# EAGLE design cyberspace-1-clock-card (EAGLE 9.6.2)
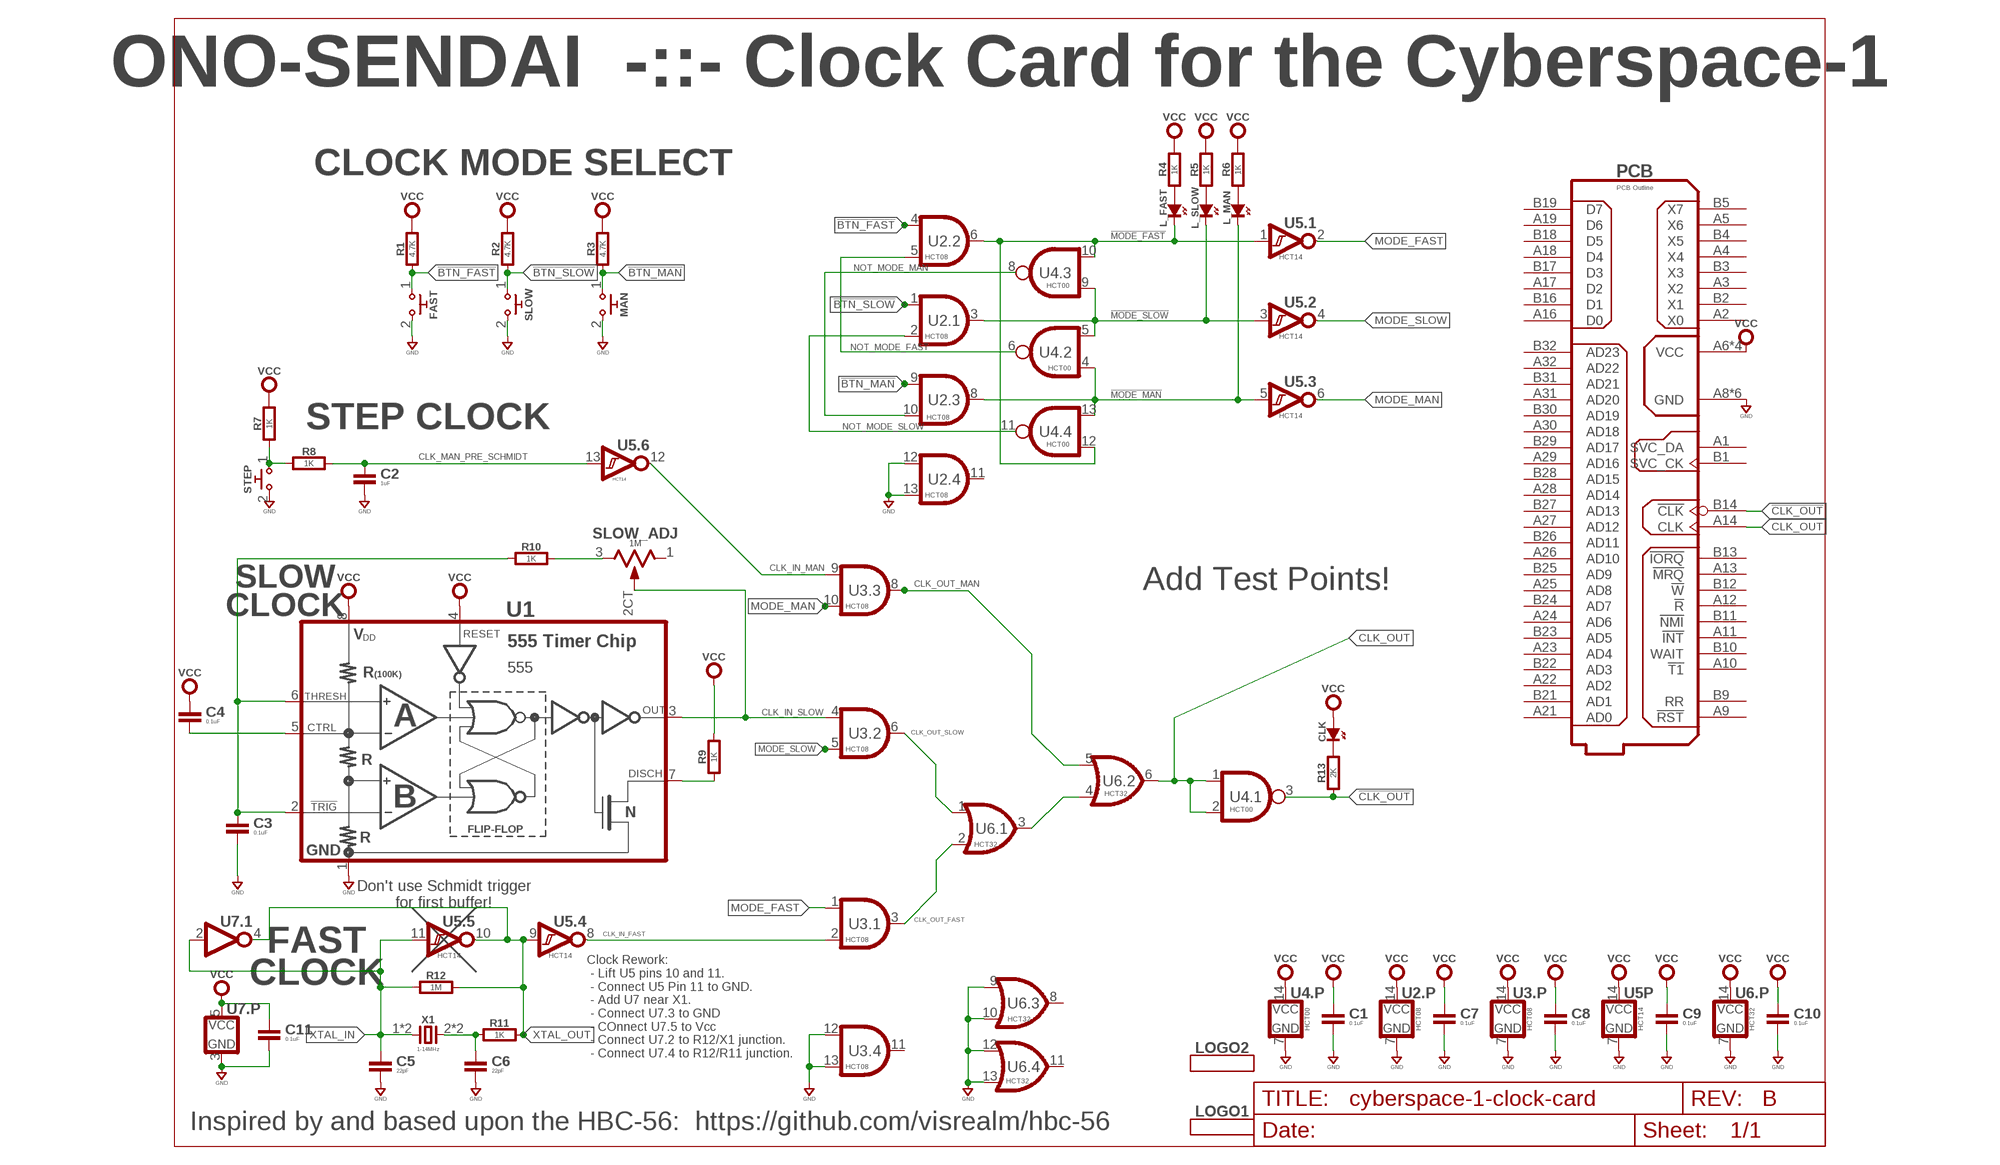
[diagram p0: schematic, sheet 1]
U$1 (DINA4_L-SMALLDOC): REV: B

## Parts
C1  0.1uF  CAPACITOR0603  [0603-CAP]
C2  1uF  CAPACITOR0603  [0603-CAP]
C3  0.1uF  CAPACITOR0603  [0603-CAP]
C4  0.1uF  CAPACITOR0603  [0603-CAP]
C5  22pF  CAPACITOR0603  [0603-CAP]
C6  22pF  CAPACITOR0603  [0603-CAP]
C7  0.1uF  CAPACITOR0603  [0603-CAP]
C8  0.1uF  CAPACITOR0603  [0603-CAP]
C9  0.1uF  CAPACITOR0603  [0603-CAP]
C10  0.1uF  CAPACITOR0603  [0603-CAP]
C11  0.1uF  CAPACITOR0603  [0603-CAP]
CLK  SMT0603  [SMD_0603]
FAST  TACTILESPST-RA-6X6  [TC-0202]
L_FAST  SMT0603  [SMD_0603]
L_MAN  SMT0603  [SMD_0603]
L_SLOW  SMT0603  [SMD_0603]
LOGO1  SOZU-BRAND-LOGO-20MM  [SOZU-20MM]
LOGO2  CHRONOS-LOGO-20MM  [CHRONOS2-20MM]
MAN  TACTILESPST-RA-6X6  [TC-0202]
PCB  PCB Outline  CYBERSPACE-1-CARD-1A  [CYBERSPACE-CARD-TYPE-1A]
R1  4.7K  RESISTOR0603  [0603-RES]
R2  4.7K  RESISTOR0603  [0603-RES]
R3  4.7K  RESISTOR0603  [0603-RES]
R4  1K  RESISTOR0603  [0603-RES]
R5  1K  RESISTOR0603  [0603-RES]
R6  1K  RESISTOR0603  [0603-RES]
R7  1K  RESISTOR0603  [0603-RES]
R8  1K  RESISTOR0603  [0603-RES]
R9  1K  RESISTOR0603  [0603-RES]
R10  1K  RESISTOR0603  [0603-RES]
R11  1K  RESISTOR0603  [0603-RES]
R12  1M  RESISTOR0603  [0603-RES]
R13  2K  RESISTOR0603  [0603-RES]
SLOW  TACTILESPST-RA-6X6  [TC-0202]
SLOW_ADJ  1M  CERMET_MULTI_TURN-3006P  [CERMET_MULTI_3006P_THD]
STEP  TACTILESPST-RA-6X6  [TC-0202]
U1  555  555SOIC  [SOP08]
U2  HCT08  74HCT08D  [SOP14]
U3  HCT08  74HCT08D  [SOP14]
U4  HCT00  74AHCT00D  [SOP14]
U5  HCT14  74HCT14D  [SOP14]
U6  HCT32  74HCT32D  [SOP14]
U7  74HCT1G-TSOP504  [TSOP-5]
X1  1-14MHz  2PATS_DUAL_SMD_THD  [ATSXXXX]

## Nets
!BTN_FAST: FAST.1 R1.1 U2.4(.2:A)
!BTN_MAN: MAN.1 R3.1 U2.9(.3:A)
!BTN_SLOW: R2.1 SLOW.1 U2.1(.1:A)
!CLK_OUT: PCB.B14(!CLK) R13.1 U4.3(.1:Y)
!MODE_FAST: L_FAST.K(C) U2.6(.2:Y) U4.10(.3:A) U4.12(.4:B) U5.1(.1:A)
!MODE_MAN: L_MAN.K(C) U2.8(.3:Y) U4.4(.2:A) U4.13(.4:A) U5.5(.3:A)
!MODE_SLOW: L_SLOW.K(C) U2.3(.1:Y) U4.5(.2:B) U4.9(.3:B) U5.3(.2:A)
CLK_IN_FAST: U3.2(.1:B) U5.8(.4:Y)
CLK_IN_MAN: U3.9(.3:A) U5.12(.6:Y)
CLK_IN_SLOW: SLOW_ADJ.2CT U1.3(OUTPUT) U3.4(.2:A)
CLK_MAN_PRE_SCHMIDT: C2.1 R8.2 U5.13(.6:A)
CLK_OUT: PCB.A14(CLK) U4.1(.1:A) U4.2(.1:B) U6.6(.2:Y)
CLK_OUT_FAST: U3.3(.1:Y) U6.2(.1:B)
CLK_OUT_MAN: U3.8(.3:Y) U6.5(.2:B)
CLK_OUT_SLOW: U3.6(.2:Y) U6.1(.1:A)
GND: C1.2 C2.2 C3.2 C5.2 C6.2 C7.2 C8.2 C9.2 C10.2 C11.2 FAST.2 MAN.2 PCB.A8(GND) PCB.A15(GND) PCB.A20(GND) PCB.B8(GND) PCB.B15(GND) PCB.B20(GND) SLOW.2 STEP.2 U1.1(GND) U2.7(.P:GND) U2.12(.4:A) U2.13(.4:B) U3.7(.P:GND) U3.12(.4:A) U3.13(.4:B) U4.7(.P:GND) U5.7(P:GND) U6.7(.P:GND) U6.9(.3:A) U6.10(.3:B) U6.12(.4:A) U6.13(.4:B) U7.3(.P:GND)
MODE_FAST: U3.1(.1:A) U5.2(.1:Y)
MODE_MAN: U3.10(.3:B) U5.6(.3:Y)
MODE_SLOW: U3.5(.2:B) U5.4(.2:Y)
N$1: C3.1 R10.1 U1.2(TRIGGER#) U1.6(THRESHOLD)
N$2: R9.1 U1.7(DISCHARGE)
N$3: C4.2 U1.5(CONTROL)
N$4: C6.1 R11.1 X1.2 X1.2SMD
N$5: R10.2 SLOW_ADJ.3
N$6: U6.3(.1:Y) U6.4(.2:A)
N$7: L_FAST.A R4.1
N$8: R7.1 R8.1 STEP.1
N$9: L_SLOW.A R5.1
N$10: L_MAN.A R6.1
N$11: CLK.K(C) R13.2
NOT_MODE_FAST: U2.5(.2:B) U4.6(.2:Y)
NOT_MODE_MAN: U2.10(.3:B) U4.8(.3:Y)
NOT_MODE_SLOW: U2.2(.1:B) U4.11(.4:Y)
VCC: C1.1 C4.1 C7.1 C8.1 C9.1 C10.1 C11.1 CLK.A PCB.A6(VCC) PCB.A7(VCC) PCB.B6(VCC) PCB.B7(VCC) R1.2 R2.2 R3.2 R4.2 R5.2 R6.2 R7.2 R9.2 U1.4(RESET#) U1.8(VDD) U2.14(.P:VCC) U3.14(.P:VCC) U4.14(.P:VCC) U5.14(P:VCC) U6.14(.P:VCC) U7.5(.P:VCC)
XTAL_IN: C5.1 R12.1 U5.11(.5:A) U7.2(.1:A) X1.1 X1.1SMD
XTAL_OUT: R11.2 R12.2 U5.9(.4:A) U5.10(.5:Y) U7.4(.1:Y)
Unconnected: PCB.A1(SVC_DA) PCB.A2(X0) PCB.A3(X2) PCB.A4(X4) PCB.A5(X6) PCB.A9(!RST) PCB.A10(!T1) PCB.A11(!INT) PCB.A12(!R) PCB.A13(!MRQ) PCB.A16(D0) PCB.A17(D2) PCB.A18(D4) PCB.A19(D6) PCB.A21(AD0) PCB.A22(AD2) PCB.A23(AD4) PCB.A24(AD6) PCB.A25(AD8) PCB.A26(AD10) PCB.A27(AD12) PCB.A28(AD14) PCB.A29(AD16) PCB.A30(AD18) PCB.A31(AD20) PCB.A32(AD22) PCB.B1(SVC_CK) PCB.B2(X1) PCB.B3(X3) PCB.B4(X5) PCB.B5(X7) PCB.B9(RR) PCB.B10(WAIT) PCB.B11(!NMI) PCB.B12(!W) PCB.B13(!IORQ) PCB.B16(D1) PCB.B17(D3) PCB.B18(D5) PCB.B19(D7) PCB.B21(AD1) PCB.B22(AD3) PCB.B23(AD5) PCB.B24(AD7) PCB.B25(AD9) PCB.B26(AD11) PCB.B27(AD13) PCB.B28(AD15) PCB.B29(AD17) PCB.B30(AD19) PCB.B31(AD21) PCB.B32(AD23) SLOW_ADJ.1 U2.11(.4:Y) U3.11(.4:Y) U6.8(.3:Y) U6.11(.4:Y)

## Notes on the sheet
- ONO-SENDAI  -::- Clock Card for the Cyberspace-1
- CLOCK MODE SELECT
- STEP CLOCK
- SLOW
  CLOCK
- Add Test Points!
- Don't use Schmidt trigger
  for first buffer!
- FAST
  CLOCK
- Clock Rework:
   - Lift U5 pins 10 and 11.
   - Connect U5 Pin 11 to GND.
   - Add U7 near X1.
   - Connect U7.3 to GND
   - COnnect U7.5 to Vcc
   - Connect U7.2 to R12/X1 junction.
   - Connect U7.4 to R12/R11 junction.
- Inspired by and based upon the HBC-56:  https://github.com/visrealm/hbc-56

## Library data of the parts
C1-C11 = rlc:CAPACITOR: Capacitor; COST01: 0.12; COST10: 0.09; COST100: 0.05
CLK L_FAST L_MAN L_SLOW = led:SMT: LED SMT; COST01: 0.20; COST10: 0.17; COST100: 0.14
FAST MAN SLOW STEP = switch-thd:TACTILE: Push Sw.
LOGO1 = gfx-glyphs:SOZU-BRAND-LOGO: Logo for the Sozu ficticious brand
LOGO2 = gfx-glyphs:CHRONOS-LOGO: Chronos 2 - Logo
PCB = con-edge:CYBERSPACE-1-CARD: Card for the CyberSpace 1 System
R1-R13 = rlc:RESISTOR: Resistor; COST01: 0.10; COST10: 0.05; COST100: 0.02
SLOW_ADJ = rlc:CERMET_MULTI_TURN: Cermet Style, Multiturn Potentiometer; COST01: 2.00; COST10: 1.70; COST100: 1.40; MFR: BOURNES; MPN: 3006P; TAYDA: https://www.taydaelectronics.com/potentiometer-variable-resistors/cermet-potentiometers.html
U1 = logic:555: Timer Chip; MFR: TI; MPN: NE555PSR
U2 U3 = logic:74*08?: Quad AND Gate; COST01: 0.50; COST10: 0.35; COST100: 0.20; MPN: 74HCT08D
U4 = logic:74*00?: Quad Nand Gate; MPN: 74HCT00D
U5 = logic:74*14?: Hex Schmidt Inverter; COST01: 0.45; COST10: 0.35; COST100: 0.20; MPN: 74HCT14D
U6 = logic:74*32?: Quad OR; COST01: 0.45; COST10: 0.35; COST100: 0.20; MPN: 74HCT32D
U7 = logic:74*1G?04: Single Gate Inverter; COST01: 0.35; COST10: 0.24; COST100: 0.12; MFR: Nexperia; MPN: 74HCT1G04GV
X1 = xtal:2P: Crystal

## Board
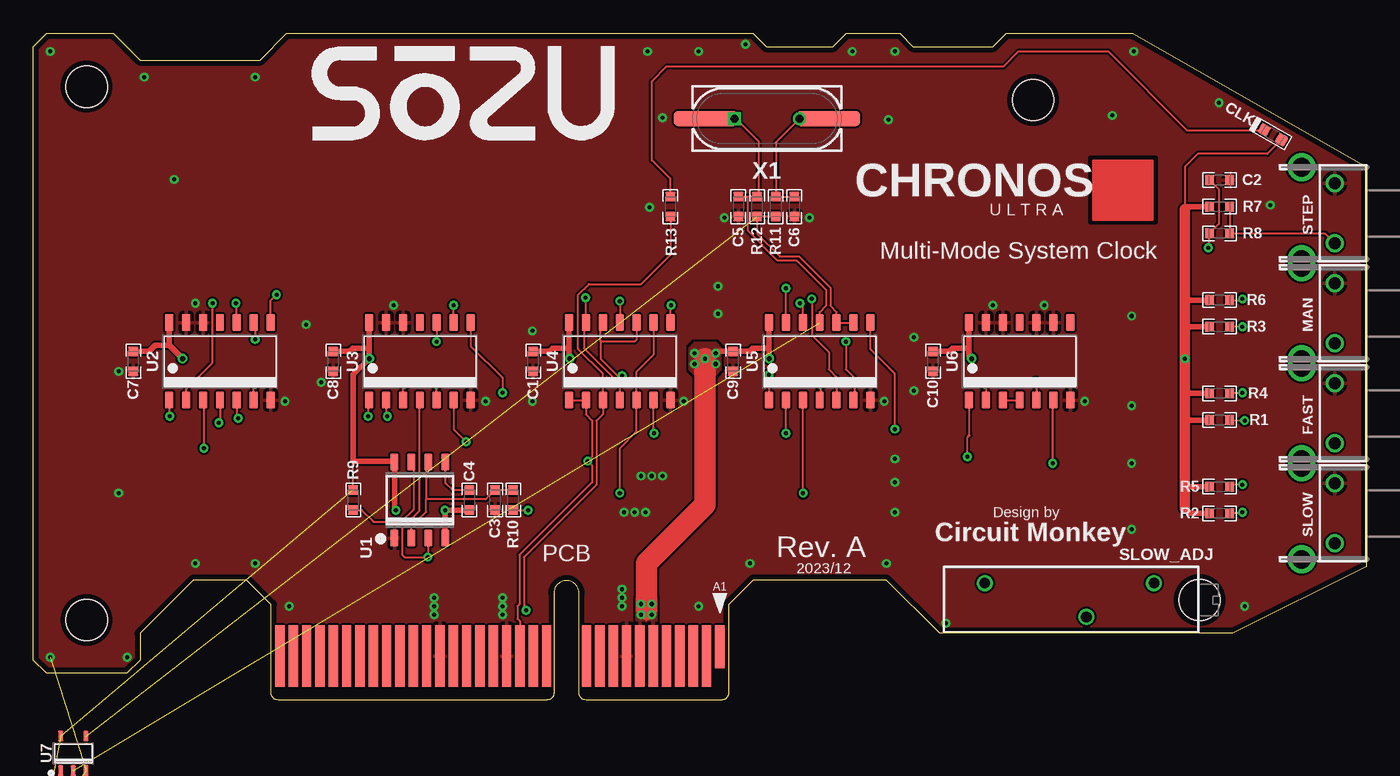
[diagram p1: board, top side]
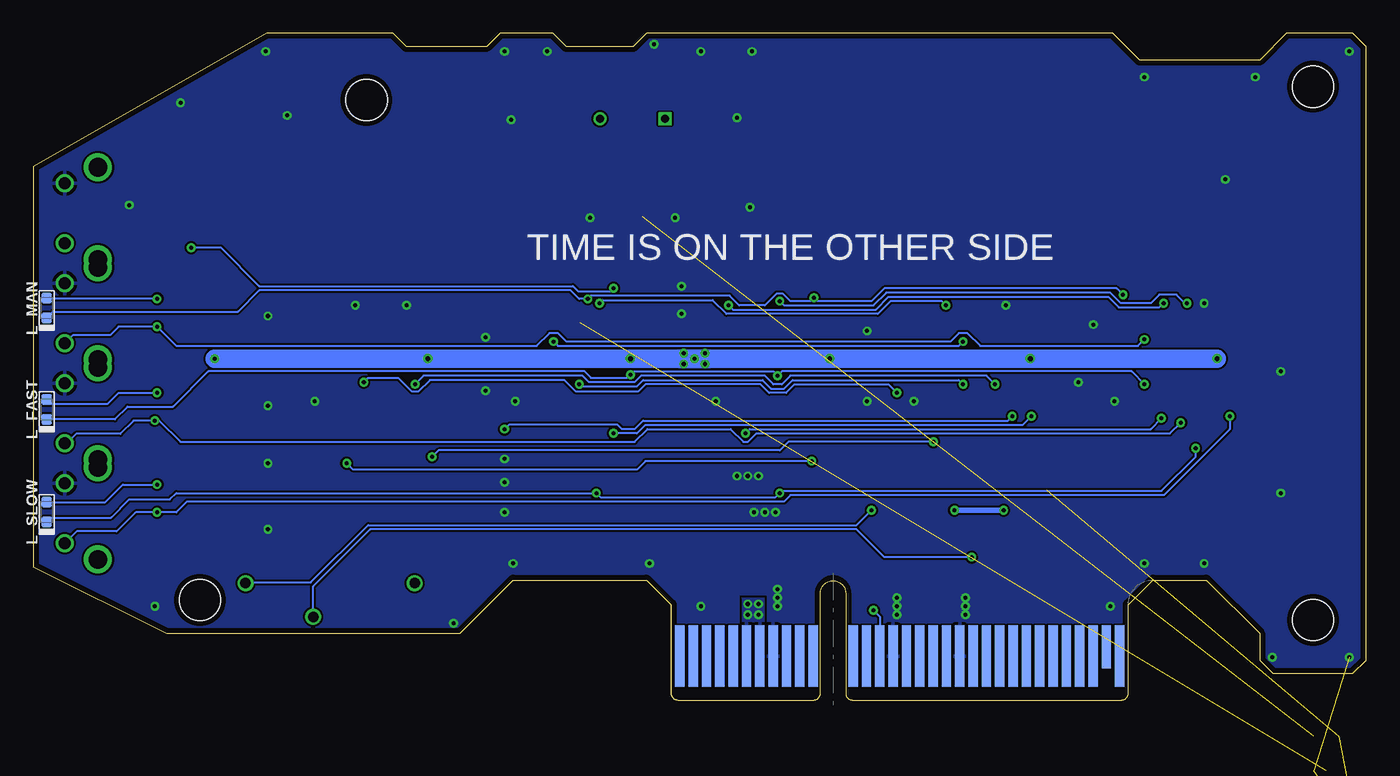
[diagram p2: board, bottom side, seen from below]

Size 100 x 50 mm. Coordinates in mm from the lower left corner, seen from the top.
Copper layers (1*16): Top 0.0356mm / dielectric 1.5011mm / Bottom 0.0356mm
Design rules "OSH-CircuitMonkey *": minimum track width 6mil, minimum drill 12mil, track to track 6mil, track to pad 6mil, pad to pad 6mil, via to via 6mil, smd to smd 6mil, copper to edge 15mil, drill to drill 6mil, minimum pad ring 7mil, minimum via ring 7mil, stop-mask expansion 3mil, vias tented up to drill 15mil, thermal gap 10mil

### Footprints (pad centres in the part's own frame; a part is rotated, then mirrored left to right if it is on the bottom)
0603-CAP = smd 0.711 x 0.762: 1 -0.752,0; 2 0.752,0
SMD_0603 = smd 0.8 x 0.8: A 0.75,0; K -0.75,0
TC-0202 = drill 0.9: 1 -2.25,2.35; 2 2.25,2.35 | drill 1.4: MT1 -3.45,4.85; MT2 3.45,4.85
CYBERSPACE-CARD-TYPE-1A = smd 0.7 x 3.2: A1 11.5,4 | smd 0.7 x 4.6: A2 10.5,3.3; A3 9.5,3.3; A4 8.5,3.3; A5 7.5,3.3; A6 6.5,3.3; A7 5.5,3.3; A8 4.5,3.3; A9 3.5,3.3; A10 2.5,3.3; A11 1.5,3.3; A12 -1.5,3.3; A13 -2.5,3.3; A14 -3.5,3.3; A15 -4.5,3.3; A16 -5.5,3.3; A17 -6.5,3.3; A18 -7.5,3.3; A19 -8.5,3.3; A20 -9.5,3.3; A21 -10.5,3.3; A22 -11.5,3.3; A23 -12.5,3.3; A24 -13.5,3.3; A25 -14.5,3.3; A26 -15.5,3.3; A27 -16.5,3.3; A28 -17.5,3.3; A29 -18.5,3.3; A30 -19.5,3.3; A31 -20.5,3.3; A32 -21.5,3.3 | smd 0.7 x 4.6 bottom: B1 11.5,3.3; B2 10.5,3.3; B3 9.5,3.3; B4 8.5,3.3; B5 7.5,3.3; B6 6.5,3.3; B7 5.5,3.3; B8 4.5,3.3; B9 3.5,3.3; B10 2.5,3.3; B11 1.5,3.3; B12 -1.5,3.3; B13 -2.5,3.3; B14 -3.5,3.3; B15 -4.5,3.3; B16 -5.5,3.3; B17 -6.5,3.3; B18 -7.5,3.3; B19 -8.5,3.3; B20 -9.5,3.3; B21 -10.5,3.3; B22 -11.5,3.3; B23 -12.5,3.3; B24 -13.5,3.3; B25 -14.5,3.3; B26 -15.5,3.3; B27 -16.5,3.3; B28 -17.5,3.3; B29 -18.5,3.3; B30 -19.5,3.3; B32 -21.5,3.3 | smd 0.7 x 3.2 bottom: B31 -20.5,4 | hole 3.1: -36,46; -36,6; 47.5,7.5; 35,45
0603-RES = smd 0.711 x 0.762: 1 -0.752,0; 2 0.752,0
CERMET_MULTI_3006P_THD = drill 0.8: 1 -7.62,1.27; 2CT 0,-1.27; 3 5.08,1.27
SOP08 = smd 0.6 x 1.3: 1 -1.905,-2.85; 2 -0.635,-2.85; 3 0.635,-2.85; 4 1.905,-2.85; 5 1.905,2.85; 6 0.635,2.85; 7 -0.635,2.85; 8 -1.905,2.85
SOP14 = smd 1.27 x 0.635: 1 -2.9,3.81; 2 -2.9,2.54; 3 -2.9,1.27; 4 -2.9,0; 5 -2.9,-1.27; 6 -2.9,-2.54; 7 -2.9,-3.81; 8 2.9,-3.81; 9 2.9,-2.54; 10 2.9,-1.27; 11 2.9,0; 12 2.9,1.27; 13 2.9,2.54; 14 2.9,3.81
TSOP-5 = smd 0.4 x 0.8: 1 -0.95,-1.3; 2 0,-1.3; 3 0.95,-1.3; 4 0.95,1.3; 5 -0.95,1.3
ATSXXXX = drill 0.6 square: 1 -2.44,0 | smd 4.8 x 1.1: 1SMD -4.6,0; 2SMD 4.6,0 | drill 0.6: 2 2.44,0

### Placement (x,y rotation side)
C1  37.5,25.4 270 top
C2  89,39 0 top
C3  34.64,15 270 top
C4  32.72,15 90 top
C5  52.9,37 270 top
C6  57.1,37 270 top
C7  7.5,25.4 270 top
C8  22.5,25.4 270 top
C9  52.5,25.4 270 top
C10  67.5,25.4 270 top
C11  2,-7 0 top  (outside the outline)
CLK  93,42.4 330 top
FAST  100,21.5 90 top
L_FAST  99,21.8 90 bottom
L_MAN  99,29.4 90 bottom
L_SLOW  99,14.1 90 bottom
LOGO1  32.6,40 0 top
LOGO2  73.1,38.4 0 top
MAN  100,29 90 top
PCB  40,0 0 top
R1  89,21 180 top
R2  89,14 180 top
R3  89,28 180 top
R4  89,23 180 top
R5  89,16 180 top
R6  89,30 180 top
R7  89,37 180 top
R8  89,35 180 top
R9  24,15 90 top
R10  36,15 270 top
R11  55.7,37 270 top
R12  54.3,37 270 top
R13  47.8,37 90 top
SLOW  100,14 90 top
SLOW_ADJ  79,7.5 0 top
STEP  100,36.5 90 top
U1  29,15 0 top
U2  14,25.4 90 top
U3  29,25.4 90 top
U4  44,25.4 90 top
U5  59,25.4 90 top
U6  74,25.4 90 top
U7  3,-4 0 top
X1  55.04,43.6 0 top

### Tracks (layer width: path | path; a pad name or v marks a point on that pad's centre or on a via)
!BTN_FAST  (via drill 0.3)
  Top 0.152: U2.4 14,20.88 v13.92,20.8 | v90.88,20.96 89.79,20.96 R1.1
  Bottom 0.152: v13.92,20.8 14.72,20 45.76,20 46.4,19.36 46.72,19.36 47.68,20.32 53.92,20.32 54.88,19.36 88.96,19.36 90.56,20.96 v90.88,20.96 92.48,20.96 93.47,19.97 96.8,19.97 97.52,19.25 FAST.1
!BTN_MAN  (via drill 0.3)
  Top 0.152: U2.9 16.64,28.2 v16.64,27.04 | v90.72,28 R3.1
  Bottom 0.152: v16.64,27.04 17.12,26.56 28.96,26.56 29.92,27.52 30.56,27.52 31.2,26.88 60,26.88 60.64,27.52 61.28,27.52 62.24,26.56 89.28,26.56 v90.72,28 93.6,28 94.24,27.36 97.04,27.36 MAN.1
!BTN_SLOW  (via drill 0.3)
  Top 0.152: U2.1 10.19,21.33 v10.24,21.28 | v90.72,14.08 90.64,14 R2.1
  Bottom 0.152: v10.24,21.28 10.24,20.32 15.2,15.36 43.2,15.36 43.68,14.88 88.48,14.88 89.28,14.08 v90.72,14.08 92.32,14.08 93.76,12.64 96.76,12.64 SLOW.1
!CLK_OUT  (via drill 0.3)
  Top 0.152: v36.96,6.72 36.8,6.88 36.8,10.72 42.24,16.16 42.24,20.96 42.73,21.45 U4.3 42.73,24.47 40.88,26.32 40.88,30.4 41.68,31.2 45.6,31.2 47.8,33.4 R13.1
  Bottom 0.152: v36.96,6.72 36.48,6.24 36.48,3.32 PCB.B14
!MODE_FAST  (via drill 0.3)
  Top 0.152: U2.6 16.54,23.58 v16.64,23.68 | v44.16,24.32 43.84,24.32 42.56,25.6 42.56,26.88 | 42.56,26.88 42.56,28.13 U4.12 | U4.10 45.27,27.03 45.12,26.88 42.56,26.88 | v55.2,24.4 U5.1
  Bottom 0.152: v16.64,23.68 17.6,24.64 43.84,24.64 v44.16,24.32 44.48,24.64 54.96,24.64 v55.2,24.4 55.44,24.16 58.16,24.16 58.64,24.64 86.88,24.64 89.51,22.01 92.92,22.01 93.88,21.05 L_FAST.K
!MODE_MAN  (via drill 0.3)
  Top 0.152: U2.8 17.81,29.97 v18.24,30.4 | v41.44,30.16 41.44,28.32 U4.13 41.3,28.14 41.3,26.38 44,23.68 U4.4 | v58.4,30.08 58.4,27.36 59.68,26.08 59.68,24.8 60.27,24.21 U5.5
  Bottom 0.152: v18.24,30.4 18.72,30.88 36.16,30.88 37.12,29.92 41.2,29.92 v41.44,30.16 41.68,29.92 43.2,29.92 43.76,30.48 44.24,30.48 45.12,29.6 47.04,29.6 47.76,30.32 58.16,30.32 v58.4,30.08 59.04,30.08 59.68,30.72 83.04,30.72 84.64,29.12 98.53,29.12 L_MAN.K
!MODE_SLOW  (via drill 0.3)
  Top 0.152: v57.76,15.52 57.76,22.47 U5.3 | v44,15.52 44,18.88 45.27,20.15 U4.5 45.27,24.63 46.56,25.92 46.56,28.28 U4.9 | v12.8,18.88 12.8,22.43 U2.3
  Bottom 0.152: L_SLOW.K 98.68,13.67 94.17,13.67 92.8,15.04 89.76,15.04 89.28,15.52 v57.76,15.52 57.44,15.2 44.32,15.2 v44,15.52 43.84,15.68 15.36,15.68 12.8,18.24 v12.8,18.88
CLK_IN_FAST  (via drill 0.3)
  Top 0.152: v64.64,20.32 64.64,24.48 62.81,26.31 U5.8 | U3.2 26.46,21.38 v26.56,21.28
  Bottom 0.152: v64.64,20.32 64.32,20.64 56.16,20.64 55.84,20.32 54.88,20.32 54.24,20.96 26.88,20.96 v26.56,21.28
CLK_IN_MAN  (via drill 0.3)
  Top 0.152: U3.9 31.54,29.58 v31.52,29.6 | U5.12 57.73,29.5 57.52,29.71 v57.52,29.76
  Bottom 0.152: v31.52,29.6 31.84,29.92 35.68,29.92 36.64,28.96 48,28.96 49.04,30 57.28,30 v57.52,29.76
CLK_IN_SLOW  (via drill 0.3)
  Top 0.152: U3.4 28.96,22.46 28.96,14.16 27.68,12.88 27.68,10.88 27.84,10.72 v29.6,10.72 29.64,10.76 U1.3
  Bottom 0.152: v29.6,10.72 36.16,10.72 38.24,12.8 74.72,12.8 79,8.52 SLOW_ADJ.2CT
CLK_MAN_PRE_SCHMIDT  (via drill 0.3)
  Top 0.152: U5.13 56.46,30.86 v56.48,30.88 | v88.16,33.92 88.25,34.01 R8.2 88.96,35.71 88.96,38.29 C2.1
  Bottom 0.152: v56.48,30.88 56.72,30.64 59.12,30.64 59.52,31.04 83.04,31.04 85.92,33.92 v88.16,33.92
CLK_OUT  (via drill 0.3)
  Top 0.152: PCB.A14 36.5,5.9 36.32,6.08 36.32,7.04 36.48,7.2 36.48,10.88 41.92,16.32 41.92,17.6 v41.6,17.92 41.92,18.24 41.92,20.96 41.46,21.42 U4.2 U4.1 | v76.48,17.76 76.48,22.44 U6.6
  Bottom 0.152: v41.6,17.92 54.08,17.92 54.72,17.28 76,17.28 v76.48,17.76
CLK_OUT_FAST  (via drill 0.3)
  Top 0.152: U3.3 27.73,23.57 v27.84,23.68 | v71.36,23.68 71.46,23.58 U6.2
  Bottom 0.152: v27.84,23.68 28.48,24.32 43.2,24.32 43.84,23.68 44.48,23.68 45.12,24.32 54.4,24.32 54.88,23.84 58.32,23.84 58.8,24.32 70.72,24.32 v71.36,23.68
CLK_OUT_MAN  (via drill 0.3)
  Top 0.152: U3.8 32.81,26.55 35.2,24.16 v35.2,23.04 | v75.2,23.84 75.27,23.77 U6.5
  Bottom 0.152: v35.2,23.04 35.84,23.68 42.88,23.68 43.52,23.04 44.8,23.04 45.44,23.68 54.08,23.68 54.64,23.12 59.28,23.12 60.16,24 70.24,24 71.12,23.12 71.6,23.12 72.64,24.16 74.88,24.16 v75.2,23.84
CLK_OUT_SLOW  (via drill 0.3)
  Top 0.152: U3.6 31.54,20.3 v32.48,19.36 | v70.08,18.24 70.08,19.68 70.24,19.84 70.24,22.45 U6.1
  Bottom 0.152: v32.48,19.36 43.36,19.36 44,18.72 69.6,18.72 v70.08,18.24
GND  (via drill 0.3)  (2 unrouted)
  other vias: 1.28,3.2 7.04,3.2 1.28,48.64 8.32,46.72 16.64,46.72 53.42,49.18 46.08,48.64 49.92,48.64 61.44,48.64 64.64,48.64 82.56,48.64 88.96,44.8 92.8,37.12 90.88,7.04 68.48,5.76 64,10.24 53.76,10.24 49.92,7.04 44.16,7.04 44.16,7.68 44.16,8.32 35.2,6.4 35.2,7.04 35.2,7.68 30.08,6.4 30.08,7.04 30.08,7.68 19.2,7.04 16.64,10.24 12.16,10.24 18.88,22.4 33.92,22.4 27.04,29.6 12.16,29.76 6.4,24.64 21.6,23.84 37.44,22.4 37.44,27.68 48.8,22.4 63.84,22.4 72,29.6 75.84,29.6 78.88,22.4 66.08,23.2 66.08,27.2 44.32,14.08 45.12,14.08 45.92,14.08 45.6,16.8 46.4,16.8 47.2,16.8 82.4,28.8 82.4,22.08 82.4,17.76 82.4,12.8 80.96,43.84 64.16,43.52 47.2,43.68 46.24,36.96 51.84,36.16 58.24,36.16 51.36,31.04 51.36,28.96 20.48,28.16 10.56,39.04 6.4,15.52 64.64,18.08 64.64,16.32 64.64,14.08
  pour Top (rank 5): 1,2 0,3 0,49 1,50 6,50 8,48 17,48 19,50 54,50 55,49 60,49 61,50 65,50 66,49 72,49 73,50 82.5,50 100,40 100,10 90,5 68,5 64,9 54,9 52,7 52,3 18,3 18,7 16,9 12,9 8,5 8,3 7,2
  pour Bottom (rank 5): 1,2 0,3 0,49 1,50 6,50 8,48 17,48 19,50 54,50 55,49 60,49 61,50 65,50 66,49 72,49 73,50 82.5,50 100,40 100,10 90,5 68,5 64,9 54,9 52,7 52,3 18,3 18,7 16,9 12,9 8,5 8,3 7,2
MODE_FAST  (via drill 0.3)
  Top 0.152: U3.1 25.12,22.43 v25.12,21.28 | v56.48,20 56.48,22.48 U5.2
  Bottom 0.152: v25.12,21.28 25.76,20.64 54.08,20.64 54.72,20 v56.48,20
MODE_MAN  (via drill 0.3)
  Top 0.152: U3.10 30.27,26.91 v30.24,26.88 | U5.6 61.6,22.56 61.6,24.16 60.96,24.8 v60.96,26.88
  Bottom 0.152: v30.24,26.88 30.56,26.56 60.64,26.56 v60.96,26.88
MODE_SLOW  (via drill 0.3)
  Top 0.152: U3.5 30.27,23.65 v30.24,23.68 | v59.04,23.68 59.04,22.54 U5.4
  Bottom 0.152: v30.24,23.68 30.56,24 43.04,24 43.68,23.36 44.64,23.36 45.28,24 54.24,24 54.72,23.52 58.88,23.52 v59.04,23.68
N$1
  Top 0.152: U1.2 28.36,13.01 29.48,14.12 29.48,15.04 | 29.48,15.04 29.48,17.69 U1.6 | R10.1 C3.1 33.93,15.04 29.48,15.04
N$2
  Top 0.152: R9.1 24.63,14.25 25.52,13.36 27.6,13.36 28.52,14.29 28.52,17.69 U1.7
N$3
  Top 0.152: U1.5 30.91,16.3 31.45,15.75 C4.2
N$4
  Top 0.152: X1.2SMD X1.2 55.7,41.82 R11.1 C6.1
N$5  (via drill 0.3)
  Top 0.152: R10.2 v37.11,14.25 v37.12,14.24
  Bottom 0.152: v37.12,14.24 38.24,13.12 74.88,13.12 79.18,8.82 84.03,8.82 SLOW_ADJ.3
N$6
  Top 0.152: U6.3 U6.4
N$7  (via drill 0.3)
  Top 0.152: R4.1 89.79,23.04 v90.72,23.04
  Bottom 0.152: L_FAST.A 98.68,22.23 94.41,22.23 93.6,23.04 v90.72,23.04
N$8
  Top 0.152: R8.1 | R8.1 96.9,35 STEP.1 | R7.1 R8.1
N$9  (via drill 0.3)
  Top 0.152: v90.72,16.16 89.91,16.16 R5.1
  Bottom 0.152: L_SLOW.A 94.59,14.85 93.28,16.16 v90.72,16.16
N$10  (via drill 0.3)
  Top 0.152: R6.1 90.72,30 v90.72,30.08
  Bottom 0.152: v90.72,30.08 98.93,30.08 L_MAN.A
N$11
  Top 0.152: R13.2 47.8,39.08 46.4,40.48 46.4,46.4 47.52,47.52 72.8,47.52 73.92,48.64 80.64,48.64 86.56,42.72 92.3,42.72 CLK.K
NOT_MODE_FAST  (via drill 0.3)
  Top 0.152: U2.5 15.27,21.21 v15.36,21.12 | v46.56,20 46.54,20.02 U4.6
  Bottom 0.152: v46.56,20 46.24,20.32 16.16,20.32 v15.36,21.12
NOT_MODE_MAN  (via drill 0.3)
  Top 0.152: U2.10 15.27,29.69 v15.2,29.76 | U4.8 47.81,29.57 v47.84,29.6
  Bottom 0.152: v47.84,29.6 47.52,29.28 36.8,29.28 35.84,30.24 19.36,30.24 18.56,29.44 15.52,29.44 v15.2,29.76
NOT_MODE_SLOW  (via drill 0.3)
  Top 0.152: U2.2 11.46,23.3 13.44,25.28 v13.44,29.76 | v44,29.92 U4.11
  Bottom 0.152: v13.44,29.76 13.6,29.76 14.24,30.4 15.52,30.4 16.16,29.76 18.4,29.76 19.2,30.56 36,30.56 36.96,29.6 43.68,29.6 v44,29.92
VCC  (via drill 0.3, 0.35)  (2 unrouted)
  Top 0.152: 46,6 46,6.8 | R9.2 24,17.92 | CLK.A 92.58,40.96 87.36,40.96 86.4,40 86.4,36.8
  Top 0.4: R7.2 86.6,37 86.4,36.8 | R6.2 86.4,30 | R3.2 86.4,28 | R4.2 86.6,23 86.4,22.8 | R1.2 86.6,21 86.4,20.8 | R5.2 86.4,16 | R2.2 86.8,14 86.4,14.4 | U6.14 70.19,26.4 | 70.19,26.4 70.19,25.81 v70.4,25.6 | U5.14 55.19,26.4 | 55.19,26.4 v55.19,25.61 v55.2,25.6 | U4.14 40.19,26.4 | 40.19,26.4 40.19,25.65 v40.24,25.6 | U3.14 25.19,26.4 | 25.19,26.4 v25.19,25.61 | v25.19,25.61 v25.2,25.6 | U2.14 10.19,26.61 | 10.19,26.61 v11.2,25.6 | C7.1 8.7,26.15 9.16,26.61 10.19,26.61 | C8.1 23.7,26.15 23.95,26.4 25.19,26.4 | C1.1 38.7,26.15 38.95,26.4 40.19,26.4 | 55.19,26.4 53.95,26.4 53.7,26.15 C9.1 51.35,26.15 v51.2,26 | C10.1 68.7,26.15 68.95,26.4 70.19,26.4 | v25.19,25.61 24,24.42 24,17.92 27.02,17.92 U1.8 27.09,14.35 v27.2,14.24 | C4.1 v30.89,14.25 v30.88,14.24
  Top 0.406: U1.4 30.91,14.23 v30.89,14.25
  Top 0.8: 86.4,36.8 86.4,30 86.4,28 v86.4,25.6 86.4,22.8 86.4,20.8 86.4,16 86.4,14.4
  Top 1.6: 46,6.8 46,10.24 50.4,14.64 v50.4,25.6
  Bottom 0.4: v30.88,14.24 v27.2,14.24
  Bottom 1.4: v11.2,25.6 v25.2,25.6 v40.24,25.6 v55.2,25.6 v70.4,25.6 v86.4,25.6
  other vias: 49.6,26 49.6,25.2 51.2,25.2 45.6,7.2 46.4,7.2 46.4,6.4 45.6,6.4
  pour Top: 49.6,26.8 49.2,26.4 49.2,24.8 49.6,24.4 51.2,24.4 51.6,24.8 51.6,26.4 51.2,26.8
  pour Bottom: 51.52,26.32 51.6,26.24 51.6,24.96 51.52,24.88 49.28,24.88 49.2,24.96 49.2,26.24 49.28,26.32
  pour Bottom: 46.8,7.6 46.8,4.4 45.2,4.4 45.2,7.6
  pour Top: 45.2,7.6 45.2,4.4 46.8,4.4 46.8,7.6
XTAL_IN  (1 unrouted)
  Top 0.152: U5.11 59,29.1 59.48,29.58 59.48,30.76 57.28,32.96 55.84,32.96 53.6,35.2 53.6,37.75 | X1.1 X1.1SMD 52.72,43.6 54.4,41.92 54.4,37.85 R12.1 53.6,37.75 | C5.1 53.6,37.75
XTAL_OUT  (1 unrouted)
  Top 0.152: R11.2 R12.2 54.3,34.98 56,33.28 57.44,33.28 59.79,30.93 59.79,29.58 60.27,29.1 U5.10 U5.9

### Text on the board
tPlace: Multi-Mode System Clock | Design by | Circuit Monkey | Rev. A | 2023/12
bPlace: TIME IS ON THE OTHER SIDE